# Altium schematic sheet [11]-MAIN_POWER2.SchDoc
size A4
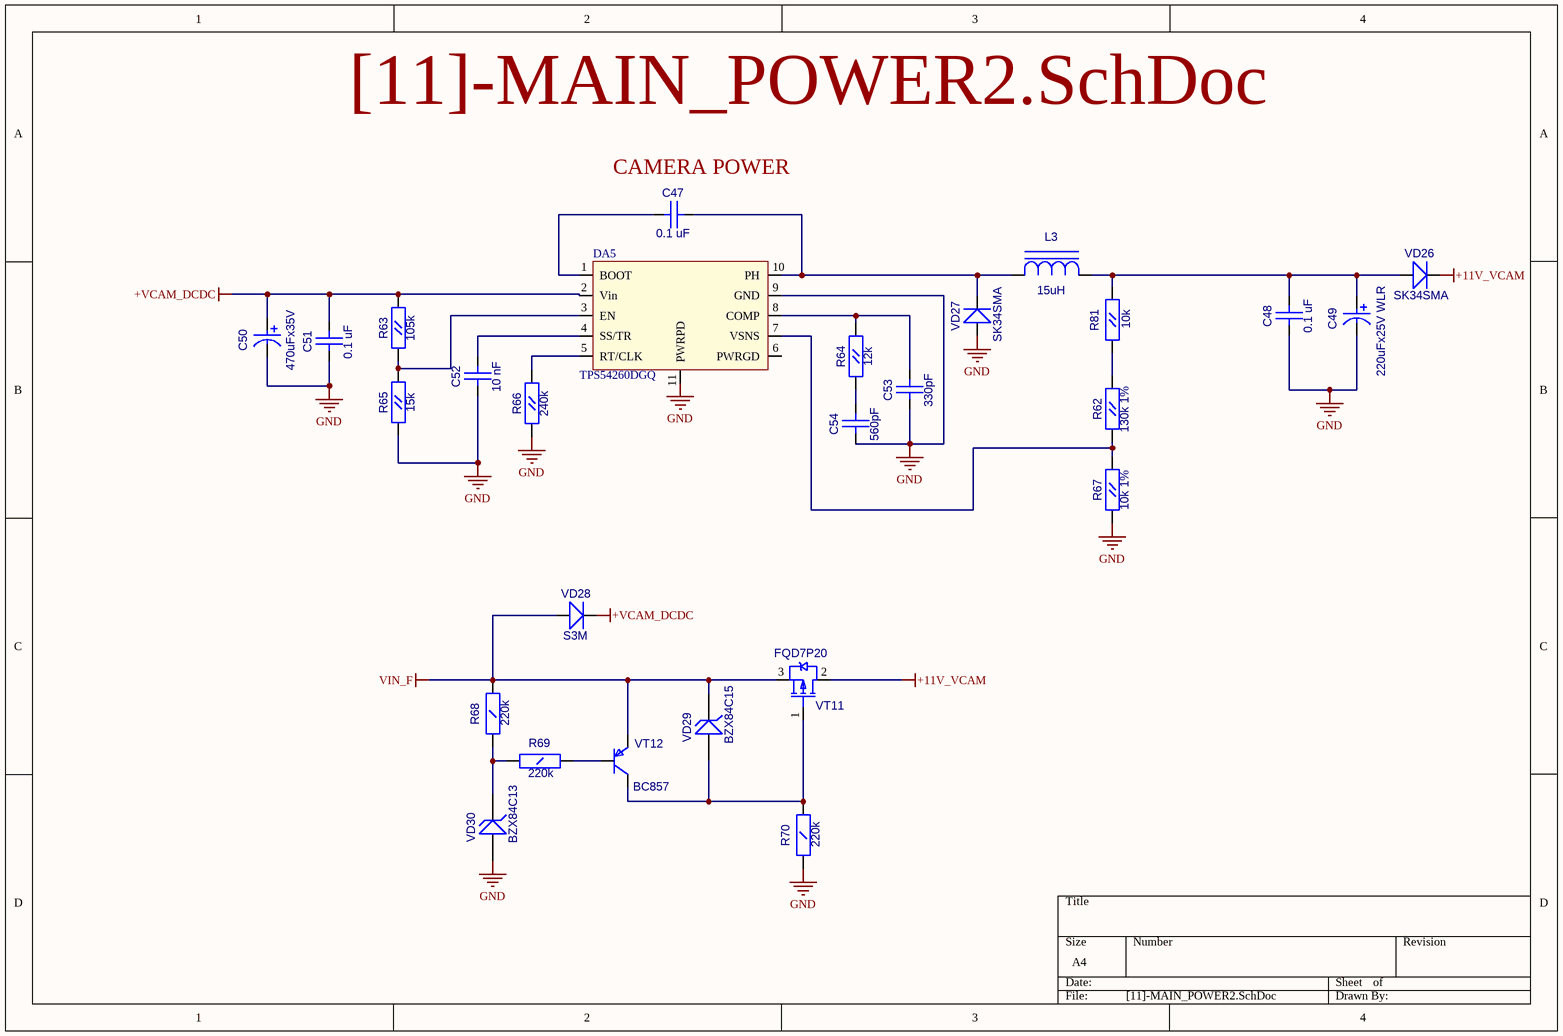
[diagram p0: [11]-MAIN_POWER2.SchDoc]

## Parts
C47  0.1 uF  [CC0603]
C48  0.1 uF  [CC0603]
C49  220uFx25V WLR  [CC8X3.5]
C50  470uFx35V  [CC16X10_CAP0.5(1)(Primary)]
C51  0.1 uF  [CC0603]
C52  10 nF  [CC0603]
C53  330pF  [CC0603]
C54  560pF  [CC0603]
DA5  TPS54260DGQ  [S-PDSO-G10]
L3  15uH  [SDR0805]
R62  130k 1%  [RC0603]
R63  105k  [RC0603]
R64  12k  [RC0603]
R65  15k  [RC0603]
R66  240k  [RC0603]
R67  10k 1%  [RC0603]
R68  220k  [RC1206]
R69  220k  [RC1206]
R70  220k  [RC1206]
R81  10k  [RC0603]
VD26  SK34SMA  [SMA]
VD27  SK34SMA  [SMA]
VD28  S3M  [SMC]
VD29  BZX84C15  [SOT-23(123)]
VD30  BZX84C13  [SOT-23(123)]
VT11  FQD7P20  [D-PAK(TO-252AA)]
VT12  BC857  [SOT-23(123)]

## Nets
+11V_VCAM: VD26.2(K) VT11.2(D)
+VCAM_DCDC: C50.2 C51.1(A) DA5.2(Vin) R63.2(B) VD28.2(K)
GND: C48.2(B) C49.2 C50.1 C51.2(B) C52.2(B) C53.2(B) C54.2(B) DA5.9(GND) DA5.11(PWRPD) R65.1(A) R66.1(A) R67.1(A) R70.1(A) VD27.1(A) VD30.1(A)
VIN_F: R68.2(B) VD28.1(A) VD29.3(K) VT11.3(S) VT12.2(E)
NetC47_1: C47.1(A) DA5.10(PH) L3.1(C) VD27.2(K)
NetC47_2: C47.2(B) DA5.1(BOOT)
NetC48_1: C48.1(A) C49.1 L3.2(A) R81.2(B) VD26.1(A)
NetC52_1: C52.1(A) DA5.4(SS/TR)
NetC53_1: C53.1(A) DA5.8(COMP) R64.2(B)
NetC54_1: C54.1(A) R64.1(A)
NetDA5_3: DA5.3(EN) R63.1(A) R65.2(B)
NetDA5_5: DA5.5(RT/CLK) R66.2(B)
NetDA5_7: DA5.7(VSNS) R62.1(A) R67.2(B)
NetR62_2: R62.2(B) R81.1(A)
NetR68_1: R68.1(A) R69.1(A) VD30.3(K)
NetR69_2: R69.2(B) VT12.1(B)
NetR70_2: R70.2(B) VD29.1(A) VT11.1(G) VT12.3(C)

Not connected (* = marked no-connect by the designer): DA5 6(PWRGD)

## Notes on the sheet
- (near C47) CAMERA POWER

## Library data of the parts
C47 C48 C51-C54 = CC0603
  C47 C48 C51: Value: 0.1 uF
  C52: Value: 10 nF
  C53: Value: 330pF
  C54: Value: 560pF
C49 = CAP0.35: Value: 220uFx25V WLR
C50 = CAP0.5(1): Value: 470uFx35V
L3 = SDR0805: Value: 15uH
R62-R67 R81 = RC0603
  R62: Value: 130k 1%
  R63: Value: 105k
  R64: Value: 12k
  R65: Value: 15k
  R66: Value: 240k
  R67: Value: 10k 1%
  R81: Value: 10k
R68-R70 = RC1206: Value: 220k
VD26 VD27 = SK34SMA: Schottky Rectifier; Value: {Value}
VD28 = S3A: Schottky Rectifier; Value: S3M
VD29 VD30 = BZX84: Zener Voltage Regulator Diode
  VD29: Value: BZX84C15
  VD30: Value: BZX84C13
VT11 = IRFR9220: HEXFET Power MOSFET; OriginalName: IRLML5103; ComponentField7: Published 8-Jun-2000; Value: FQD7P20
VT12 = BC857B: PNP 100ma transistor; OriginalName: BC846BLT1; ComponentField7: Published 29-Sep-2000; Value: BC857